# EAGLE design hot_spring (EAGLE 6.5.0)
AUTHOR: Brad Campbell, Branden Ghena; REV: A; TITLE: Hot Spring
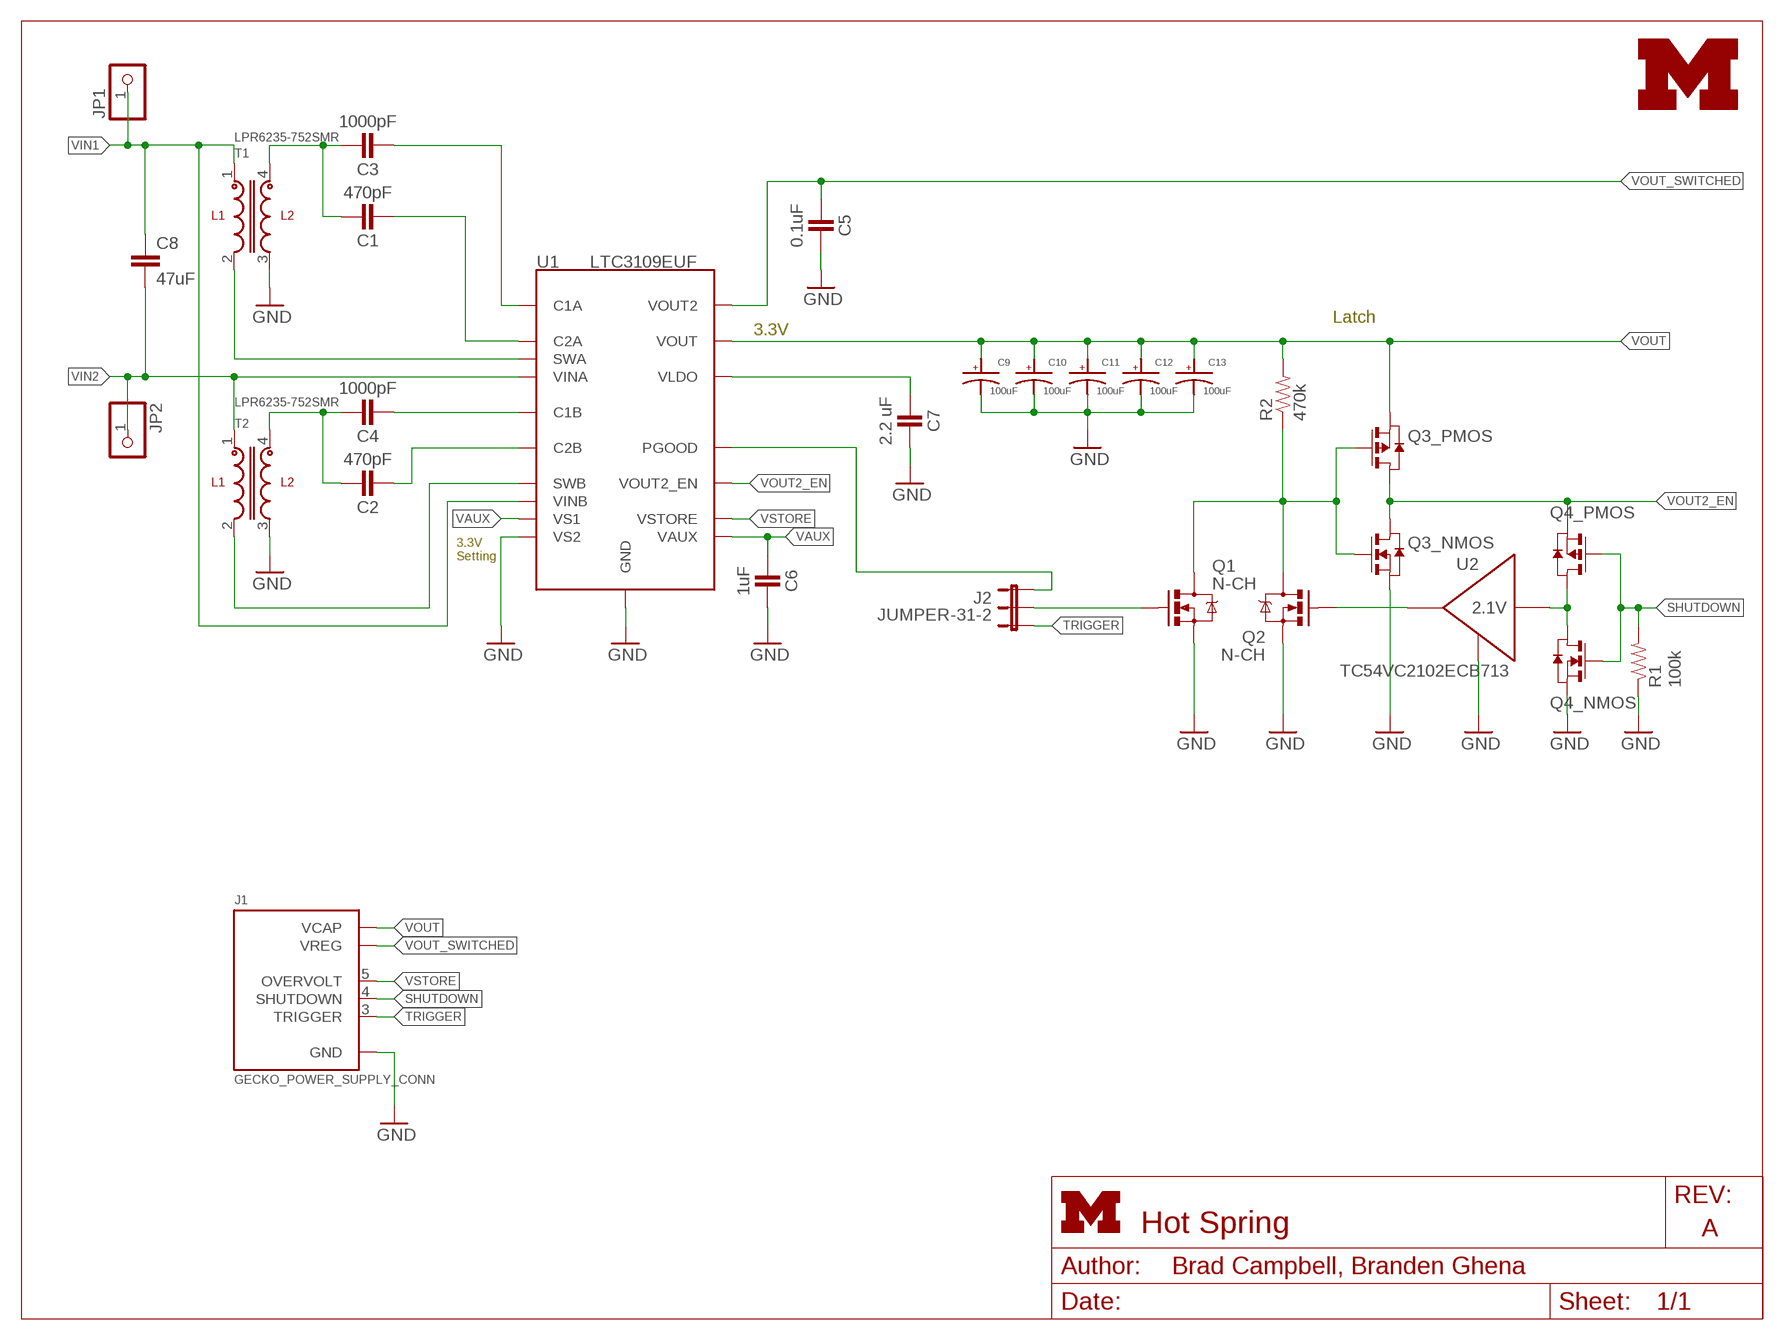
[diagram p0: schematic, sheet 1]
FRAME1 (LETTER_L): HEIGHT: 8.5in; WIDTH: 11in

## Parts
C1  470pF  CAPACITOR  [0402_CAP]
C2  470pF  CAPACITOR  [0402_CAP]
C3  1000pF  CAPACITOR  [0402_CAP]
C4  1000pF  CAPACITOR  [0402_CAP]
C5  0.1uF  CAPACITOR  [0402_CAP]
C6  1uF  CAPACITOR  [0402_CAP]
C7  2.2 uF  CAPACITOR  [0402_CAP]
C8  47uF  CAP1210  [1210]
C9  100uF  1210_CAP_POLARIZED  [CAP1210]
C10  100uF  1210_CAP_POLARIZED  [CAP1210]
C11  100uF  1210_CAP_POLARIZED  [CAP1210]
C12  100uF  1210_CAP_POLARIZED  [CAP1210]
C13  100uF  1210_CAP_POLARIZED  [CAP1210]
J1  GECKO_POWER_SUPPLY_CONN  [HEADER1X6/0.05IN]
J2  JUMPER-31-2  [SJ_3_PASTE1&2]
JP1  PINHD-1X1  [1X01]
JP2  PINHD-1X1  [1X01]
LOGO1  UMICH_SOLID_SMALL  [UMICH_SOLID_75MIL]
Q1  MOSFET-NCHANNELSMD  [SOT23-3]
Q2  MOSFET-NCHANNELSMD  [SOT23-3]
Q3  DUAL_MOSFET_NP  [TSOP-6]
Q4  DUAL_MOSFET_NP  [TSOP-6]
R1  100k  RESISTOR0402_RES  [0402_RES]
R2  470k  RESISTOR0402_RES  [0402_RES]
T1  LPR6235-752SMR  [LPR6235]
T2  LPR6235-752SMR  [LPR6235]
U1  LTC3109EUF  [QFN-20-4MM]
U2  TC54VC2102ECB713  [SOT-23]

## Nets
GND: C5.1 C6.1 C7.1 C9.ANODE C10.ANODE C11.ANODE C12.ANODE C13.ANODE J1.1(GND) Q1.2(S) Q2.2(S) Q3.5(_NMOS:S) Q4.5(_NMOS:S) R1.1 T1.3 T2.3 U1.8(GND) U1.11(GND) U1.16(GND) U1.20(VS2) U1.GND U2.2(GND)
N$1: C2.1 C4.1 T2.4
N$2: C1.1 C3.1 T1.4
N$3: C3.2 U1.18(C1A)
N$4: C1.2 U1.17(C2A)
N$5: Q4.4(_PMOS:D) Q4.6(_NMOS:D) U2.3(IN)
N$6: C4.2 U1.9(C1B)
N$7: C2.2 U1.10(C2B)
N$8: C7.2 U1.7(VLDO)
N$9: T1.2 U1.15(SWA)
N$10: T2.2 U1.12(SWB)
N$11: J2.2 Q1.1(G)
N$13: Q2.1(G) U2.1(OUT)
N$14: Q1.3(D) Q2.3(D) Q3.1(_NMOS:G) Q3.3(_PMOS:G) R2.1
PGOOD: J2.1 U1.6(PGOOD)
SHUTDOWN: J1.4(SHUTDOWN) Q4.1(_NMOS:G) Q4.3(_PMOS:G) R1.2
TRIGGER: J1.3(TRIGGER) J2.3
VAUX: C6.2 U1.2(VAUX) U1.19(VS1)
VIN1: C8.1 JP1.1 T1.1 U1.13(VINB)
VIN2: C8.2 JP2.1 T2.1 U1.14(VINA)
VOUT: C9.CATHODE C10.CATHODE C11.CATHODE C12.CATHODE C13.CATHODE J1.6(VCAP) Q3.2(_PMOS:S) R2.2 U1.3(VOUT)
VOUT2_EN: Q3.4(_PMOS:D) Q3.6(_NMOS:D) Q4.2(_PMOS:S) U1.5(VOUT2_EN)
VOUT_SWITCHED: C5.2 J1.2(VREG) U1.4(VOUT2)
VSTORE: J1.5(OVERVOLT) U1.1(VSTORE)

## Notes on the sheet
- Latch
- 3.3V
- 3.3V
  Setting
- N-CH
- 2.1V
- N-CH

## Library data of the parts
C1 C2 = passives:CAPACITOR: 0402 Capacitor; DIGIKEY: 445-1255-1-ND
C3 C4 = passives:CAPACITOR: 0402 Capacitor; DIGIKEY: 445-1256-1-ND
C5 = passives:CAPACITOR: 0402 Capacitor; DIGIKEY: 445-4952-1-ND
C6 = passives:CAPACITOR: 0402 Capacitor; DIGIKEY: 445-13185-1-ND
C7 = passives:CAPACITOR: 0402 Capacitor; DIGIKEY: 445-4999-1-ND
C8 = SparkFun-Capacitors:CAP: Capacitor Standard 0603 ceramic capacitor, and 0.1" leaded capacitor.; DIGIKEY: 399-5515-1-ND
C9-C13 = passives:1210_CAP_POLARIZED; DIGIKEY: 478-3130-1-ND
J1 = gecko:GECKO_POWER_SUPPLY_CONN: Header on the gecko power supply board.
J2 = SparkFun-Passives:JUMPER-3
JP1 JP2 = pinhead:PINHD-1X1: PIN HEADER
LOGO1 = logos:UMICH_SOLID
Q1 Q2 = fets:MOSFET-NCHANNEL: Generic NMOS footprint; DIGIKEY: FDV301NCT-ND
Q3 Q4 = fets:DUAL_MOSFET_NP: MOSFET N/P-CH 20V 2A 6-TSOP; DIGIKEY: SI3585DV-T1-E3CT-ND
R1 = passives:RESISTOR: Resistor Basic schematic elements and footprints for 0603, 1206, and PTH resistors.; DIGIKEY: RHM100KCDCT-ND
R2 = passives:RESISTOR: Resistor Basic schematic elements and footprints for 0603, 1206, and PTH resistors.; DIGIKEY: RHM470KCDCT-ND
T1 T2 = transformers:LPR6235: LPR6235 Miniature Step-Up Flyback Transformer 100:1; COILCRAFT: LPR6235-752SMR
U1 = chips:LTC3109: IC BOOST CONVERTER PMU 20QFN; DIGIKEY: LTC3109EUF#PBF-ND; NEWARK: 84R6674
U2 = chips:TC54: CMOS Voltage Detectors. 1uA quiescent current.; DIGIKEY: TC54VC2102ECB713CT-ND

## Board
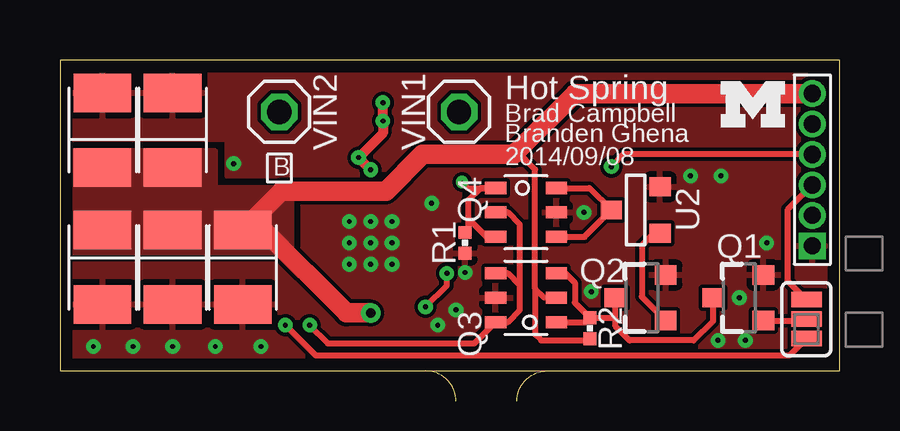
[diagram p1: board, top side]
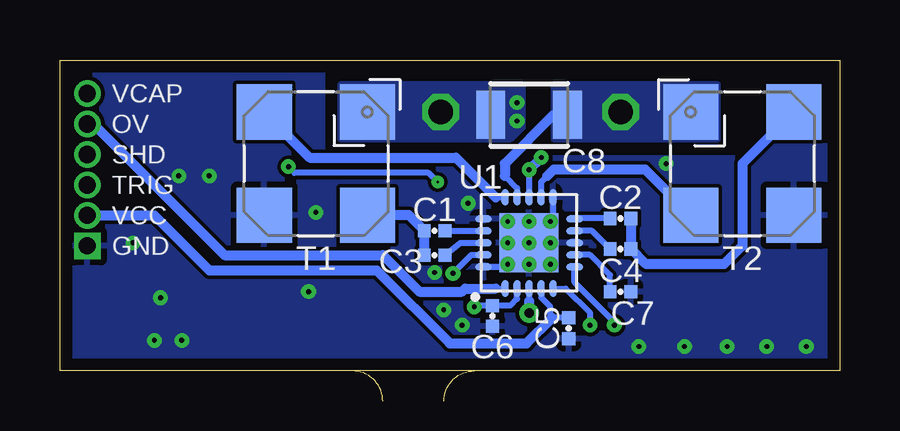
[diagram p2: board, bottom side, seen from below]

Size 32.51 x 12.95 mm. Coordinates in mm from the lower left corner, seen from the top.
Outline: 32.51,0 32.51,12.95 0,12.95 0,0 32.51,0
Copper layers (1*16): Top 0.0178mm / dielectric 59mil / Bottom 0.0178mm
Design rules "sunstone-2lyr_v1.0.0.3 *": minimum track width 6mil, minimum drill 14mil, track to track 6mil, track to pad 6mil, pad to pad 6mil, via to via 6mil, smd to smd 6mil, copper to edge 20mil, drill to drill 16mil, minimum pad ring 8mil, minimum via ring 8mil, stop-mask expansion 3mil, vias tented up to drill 20mil, thermal gap 10mil
Milling: 7 lines

### Footprints (pad centres in the part's own frame; a part is rotated, then mirrored left to right if it is on the bottom)
0402_CAP = smd 0.536 x 0.546: 1 -0.433,0; 2 0.433,0
1210 = smd 1.2 x 2: 1 -1.6,0; 2 1.6,0
CAP1210 = smd 2.4 x 1.6: ANODE 0,-1.55; CATHODE 0,1.55
HEADER1X6/0.05IN = drill 0.711 pad 1.016 square: 1 -2.54,0 | drill 0.711 pad 1.016: 2 -1.27,0; 3 0,0; 4 1.27,0; 5 2.54,0; 6 3.81,0
SJ_3_PASTE1&2 = smd 0.635 x 1.27: 1 -0.813,0; 2 0,0; 3 0.813,0
1X01 = drill 1.016 octagon: 1 0,0
SOT23-3 = smd 0.8 x 0.9: 1 -0.95,-1; 2 0.95,-1; 3 0,1.1
TSOP-6 = smd 0.508 x 0.889: 1 -1.016,-1.27; 2 0,-1.27; 3 1.016,-1.27; 4 1.016,1.27; 5 0,1.27; 6 -1.016,1.27
0402_RES = smd 0.536 x 0.546: 1 -0.433,0; 2 0.433,0
LPR6235 = smd 2.3 x 2.3: 1 -2.15,2.15; 2 -2.15,-2.15; 3 2.15,-2.15; 4 2.15,2.15
QFN-20-4MM = smd 0.7 x 0.3: 1 -1.9,1; 2 -1.9,0.5; 3 -1.9,0; 4 -1.9,-0.5; 5 -1.9,-1; 11 1.9,-1; 12 1.9,-0.5; 13 1.9,0; 14 1.9,0.5; 15 1.9,1 | smd 0.3 x 0.7: 6 -1,-1.9; 7 -0.5,-1.9; 8 0,-1.9; 9 0.5,-1.9; 10 1,-1.9; 16 1,1.9; 17 0.5,1.9; 18 0,1.9; 19 -0.5,1.9; 20 -1,1.9 | smd 2.45 x 2.45: GND 0,0
SOT-23 = smd 0.787 x 0.889: 1 0.991,1.016; 2 -0.94,1.016; 3 0.025,-1.016

### Placement (x,y rotation side)
C1  16.89,5.84 0 bottom
C2  9.14,6.35 180 bottom
C3  16.89,4.83 0 bottom
C4  9.14,5.08 180 bottom
C5  11.3,1.78 90 bottom
C6  14.48,2.29 90 bottom
C7  9.14,3.3 180 bottom
C8  12.95,10.67 0 bottom
C9  7.62,4.32 0 top
C10  4.7,4.32 0 top
C11  1.78,4.32 0 top
C12  4.7,10.03 180 top
C13  1.78,10.03 180 top
J1  31.37,7.75 90 top
J2  31.11,2.16 90 top
JP1  16.64,10.79 0 top
JP2  9.14,10.79 0 top
LOGO1  27.56,10.16 0 top
Q1  28.32,3.05 90 top
Q2  24.26,3.05 90 top
Q3  19.43,3.05 90 top
Q4  19.43,6.6 270 top
R1  16.89,5.33 90 top
R2  22.1,1.78 270 top
T1  21.84,8.64 270 bottom
T2  4.06,8.64 0 bottom
U1  12.95,5.33 90 bottom
U2  24,6.73 270 top

### Tracks (layer width: path | path; a pad name or v marks a point on that pad's centre or on a via)
GND  (via drill 0.2)
  Bottom 0.254: U1.20 13.95,4.33 v13.84,4.45 | U1.11 11.95,6.33 v12.06,6.22
  other vias: 12.95,5.33 13.84,5.33 13.84,6.22 12.95,6.22 12.06,5.33 12.06,4.45 12.95,4.45 16.51,2.54 15.75,1.91 6.48,1.02 15.49,6.99 16.89,4.1 7.24,8.64 1.4,1.02 3.05,1.02 21.84,6.6 27.56,8.13 29.46,5.33 4.7,1.02 8.38,1.02 28.32,3.05 28.57,1.27 27.43,1.27 26.29,8.13 22.15,3.3
  pour Bottom: -1.27,13.97 -1.27,-1.27 33.02,-1.27 33.02,13.97 21.59,13.97 21.59,8.89 3.81,8.89 3.81,13.97
  pour Top: 32.89,13.59 33.02,-1.27 -1.27,-1.27 -1.27,4.45 10.16,4.45 10.16,8.13 6.99,8.13 6.99,9.65 -1.27,9.65 -1.27,13.72
N$1
  Bottom 0.406: T2.4 4.06,8.64 4.06,5.21 4.83,4.45 8.08,4.45 C4.1 C2.1
N$2
  Bottom 0.406: T1.4 17.97,6.49 C1.1 C3.1
N$3
  Bottom 0.254: C3.2 15.82,5.33 U1.18
N$4
  Bottom 0.254: C1.2 16.32,5.83 U1.17
N$5
  Top 0.254: Q4.6 22.07,7.62 U2.3 21.87,5.59 Q4.4
N$6
  Bottom 0.254: C4.2 10.33,5.83 U1.9
N$7
  Bottom 0.254: C2.2 11.04,6.35 U1.10
N$8
  Bottom 0.254: C7.2 9.58,3.99 10.42,4.83 U1.7
N$9
  Bottom 0.254: 14.35,7.23 U1.15
  Bottom 0.406: T1.2 22.1,8.89 16,8.89 14.35,7.23
N$10
  Bottom 0.254: 12.19,8.13 12.45,7.87 U1.12
  Bottom 0.406: T2.2 8.11,8.38 11.94,8.38 12.19,8.13
N$11
  Top 0.254: Q1.1 31.05,2.1 J2.2
N$13
  Top 0.254: U2.1 24.7,5.67 24.26,5.23 24.26,3.1 Q2.1
N$14
  Top 0.254: Q1.3 27.22,2.08 26.42,1.27 23.75,1.27 23.16,1.86 23.16,2.16 | 23.16,2.16 Q2.3 | Q3.1 21.92,2.03 R2.1 | R2.1 23.11,2.21 23.16,2.16 | Q3.3 21.08,4.06 21.46,3.68 21.46,2.85 R2.1
PGOOD  (via drill 0.2)
  Top 0.254: J2.1 30.4,0.64 10.67,0.64 v9.4,1.91
  Bottom 0.254: v9.4,1.91 9.4,2.03 11.05,3.69 U1.6
SHUTDOWN  (via drill 0.1, 0.2)
  Top 0.254: 17.02,6.35 17.02,7.11 17.53,7.62 Q4.1 17.02,7.62 v16.76,7.87 | 17.02,6.35 17.02,5.89 R1.2 | Q4.3 17.78,5.59 17.02,6.35 | J1.4 23.5,9.02 v22.99,8.51
  Bottom 0.254: v16.76,7.87 17.14,8.26 22.73,8.26 v22.99,8.51
TRIGGER
  Top 0.254: J2.3 30.35,3.73 30.35,6.73 J1.3
VAUX  (via drill 0.2)
  Top 0.254: v15.24,2.67 16.13,3.56 v16.13,4.06
  Bottom 0.254: U1.2 13.45,3 13.74,2.72 C6.2 15.16,2.72 v15.24,2.67 | v16.13,4.06 15.36,4.83 U1.19
VIN1  (via drill 0.2)
  Top 0.406: v13.46,11.18 v13.46,10.41 13.46,9.91 v12.45,8.89 v12.95,8.38
  Bottom 0.254: v12.95,8.38 U1.13
  Bottom 0.406: v12.95,8.38 v12.45,8.89
  pour Bottom (no thermals): 13.21,11.94 20.83,11.94 20.83,9.65 13.72,9.65 13.21,10.16
VIN2
  Bottom 0.254: 13.97,8.13 13.45,7.61 U1.14
  Bottom 0.406: C8.2 11.94,10.67 13.97,8.64 13.97,8.13
  pour Bottom (no thermals): 5.08,11.94 11.94,11.94 11.94,9.65 5.08,9.65
VOUT  (via drill 0.41)
  Top 0.254: Q3.2 20.19,3.05 19.81,3.43 | 19.81,3.43 19.81,8.38 19.05,9.14 | 19.81,3.43 19.81,1.52 20.07,1.27 22.02,1.27 R2.2
  Top 0.813: J1.6 21.46,11.56 19.05,9.14 18.92,9.02 15.11,9.02 13.59,7.49 9.24,7.49 C9.CATHODE 8.48,5.87 11.94,2.41 v12.95,2.41
  Bottom 0.254: U1.3 12.95,2.92
  Bottom 0.406: 12.95,2.92 v12.95,2.41
  pour Top (no thermals): 0,9.14 0,4.95 9.65,4.95 9.65,7.62 6.48,7.62 6.48,9.14
VOUT2_EN  (via drill 0.2)
  Top 0.254: 19.18,3.56 19.18,2.54 18.67,2.03 Q3.6 17.27,1.14 11.18,1.14 v10.41,1.91 | 19.18,3.56 18.67,4.06 Q3.4 | 19.18,3.56 19.18,6.1 18.67,6.6 Q4.2
  Bottom 0.254: U1.5 11.43,3.43 10.41,2.41 v10.41,1.91
VOUT_SWITCHED
  Bottom 0.254: C5.2 11.99,2.21 12.06,2.29 12.06,2.67 12.45,3.05 U1.4
  Bottom 0.406: J1.2 28.57,6.48 26.29,4.19 19.3,4.19 16.26,1.14 13.06,1.14 11.99,2.21
VSTORE
  Bottom 0.254: 14.35,3.43 U1.1
  Bottom 0.406: 14.35,3.43 15.62,3.43 15.75,3.3 17.53,3.3 19.05,4.83 25.65,4.83 31.11,10.29 J1.5

### Text on the board
tPlace: Hot Spring | VIN2 | VIN1 | Brad Campbell | Branden Ghena | B | 2014/09/08
bPlace: VCAP | OV | SHD | TRIG | VCC | GND
tDocu: Trigger | External | PGOOD